# EAGLE design LlenadoPiscina (EAGLE 7.3.0)
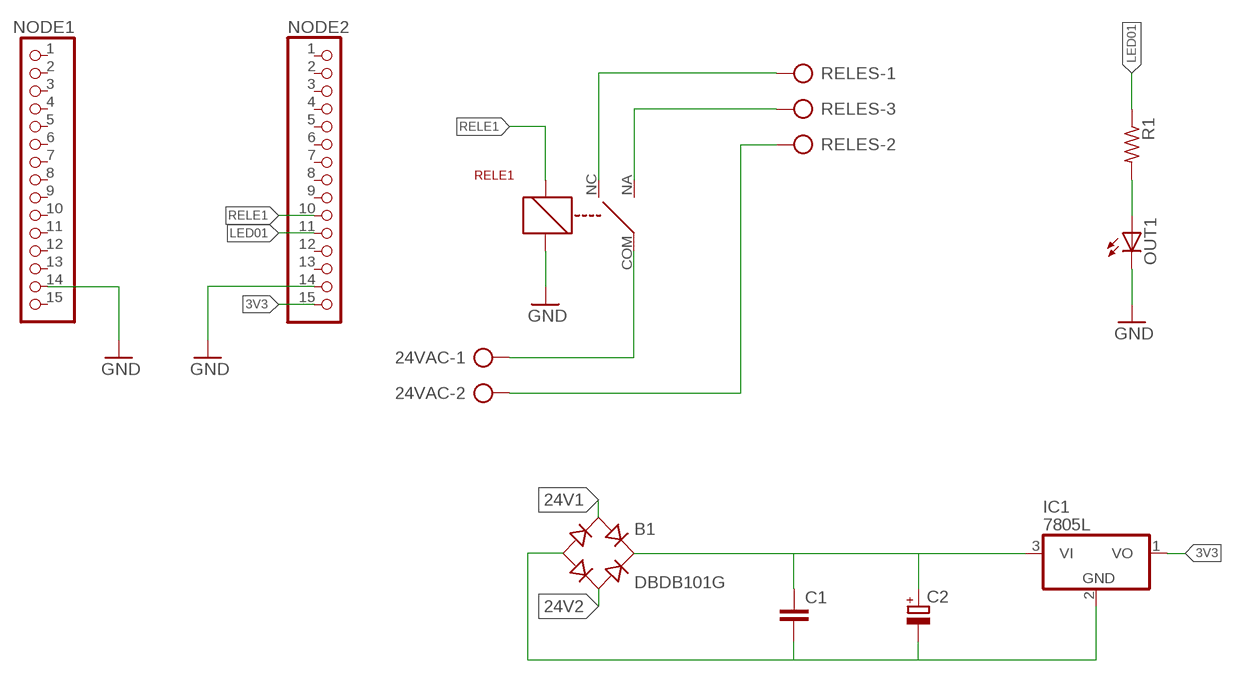
[diagram p0: schematic, sheet 1]

## Parts
24VAC  AK500/2-H  [AK500/2-H]
B1  DBDB101G  [DB]
C1  C2.5/2  [C2.5-2]
C2  CPOL-EUE2,5-6E  [E2,5-6E]
IC1  7805L  [TO92]
NODE1  PINHD-1X15  [1X15]
NODE2  PINHD-1X15  [1X15]
OUT1  LED3MM  [LED3MM]
R1  R-US_0204/7  [0204/7]
RELE1  RAS0510  [RAS0510]
RELES  AK500/3-H  [AK500/3-H]

## Nets
3V3: IC1.1(VO) NODE2.15
24V1: 24VAC.1 B1.AC1 RELE1.COM
24V2: 24VAC.2 B1.AC2 RELES.2
GND: NODE1.14 NODE2.14 OUT1.K(C) RELE1.B2
LED01: NODE2.11 R1.1
N$3: RELE1.NC RELES.1
N$4: RELE1.NA RELES.3
N$5: OUT1.A R1.2
N$6: B1.+ C1.1 C2.+ IC1.3(VI)
N$7: B1.- C1.2 C2.- IC1.2(GND)
RELE1: NODE2.10 RELE1.B1
Unconnected: NODE1.1 NODE1.2 NODE1.3 NODE1.4 NODE1.5 NODE1.6 NODE1.7 NODE1.8 NODE1.9 NODE1.10 NODE1.11 NODE1.12 NODE1.13 NODE1.15 NODE2.1 NODE2.2 NODE2.3 NODE2.4 NODE2.5 NODE2.6 NODE2.7 NODE2.8 NODE2.9 NODE2.12 NODE2.13

## Library data of the parts
24VAC = con-ptr500:AK500/2-H: CONNECTOR Aug. 2004 / PTR Meßtechnik: Die Bezeichnung der Serie AK505 wurde geändert. Es handelt sich hierbei um AK500 in horizontaler Ausführung.; OC_FARNELL: unknown; OC_NEWARK: unknown
B1 = rectifier:DB?*G: Single Phase 1.0 AMP Glass Passivated Bridge Rectifier Taiwan Semiconductor Co.,Ltd. - TSC Source: http://www.taiwansemi.com/TSCbig5/ezcatfiles/cust/img/img/db101g.pdf http://www.ts.com.tw/db/pictures/modules/PDT/PDT060207001/DBLS201G.pdf
C1 = capacitor-wima:C: CAPACITOR naming: grid - package width
C2 = resistor:CPOL-EU: POLARIZED CAPACITOR, European symbol
IC1 = linear:78*: Positive VOLTAGE REGULATOR Source: http://cache.national.com/ds/LM/LM78L05.pdf http://www.fairchildsemi.com/ds/LM/LM7805.pdf
NODE1 NODE2 = pinhead:PINHD-1X15: PIN HEADER
OUT1 = led:LED: LED OSRAM: - CHIPLED LG R971, LG N971, LY N971, LG Q971, LY Q971, LO R971, LY R971 LH N974, LH R974 LS Q976, LO Q976, LY Q976 LO Q996 - Hyper CHIPLED LW Q18S LB Q993, LB Q99A, LB R99A - SideLED LS A670, LO A670, LY A670, LG A670, LP A670 LB A673, LV A673, LT A673, LW A673 LH A674 LY A675 LS A676, LA A676, LO A676, LY A676, LW A676 LS A679, LY A679, LG A679 - Hyper Micro SIDELED® LS Y876, LA Y876, LO Y876, LY Y876 LT Y87S - SmartLED LW L88C, LW L88S LB L89C, LB L89S, LG L890 LS L89K, LO L89K, LY L89K LS L896, LA L896, LO L896, LY L896 - TOPLED LS T670, LO T670, LY T670, LG T670, LP T670 LSG T670, LSP T670, LSY T670, LOP T670, LYG T670 LG T671, LOG T671, LSG T671 LB T673, LV T673, LT T673, LW T673 LH T674 LS T676, LA T676, LO T676, LY T676, LB T676, LH T676, LSB T676, LW T676 LB T67C, LV T67C, LT T67C, LS T67K, LO T67K, LY T67K, LW E67C LS E67B, LA E67B, LO E67B, LY E67B, LB E67C, LV E67C, LT E67C LW T67C LS T679, LY T679, LG T679 LS T770, LO T770, LY T770, LG T770, LP T770 LB T773, LV T773, LT T773, LW T773 LH T774 LS E675, LA E675, LY E675, LS T675 LS T776, LA T776, LO T776, LY T776, LB T776 LHGB T686 LT T68C, LB T68C - Hyper Mini TOPLED® LB M676 - Mini TOPLED Santana® LG M470 LS M47K, LO M47K, LY M47K Source: http://www.osram.convergy.de LUXEON: - LUMILED® LXK2-PW12-R00, LXK2-PW12-S00, LXK2-PW14-U00, LXK2-PW14-V00 LXK2-PM12-R00, LXK2-PM12-S00, LXK2-PM14-U00 LXK2-PE12-Q00, LXK2-PE12-R00, LXK2-PE12-S00, LXK2-PE14-T00, LXK2-PE14-U00 LXK2-PB12-K00, LXK2-PB12-L00, LXK2-PB12-M00, LXK2-PB14-N00, LXK2-PB14-P00, LXK2-PB14-Q00 LXK2-PR12-L00, LXK2-PR12-M00, LXK2-PR14-Q00, LXK2-PR14-R00 LXK2-PD12-Q00, LXK2-PD12-R00, LXK2-PD12-S00 LXK2-PH12-R00, LXK2-PH12-S00 LXK2-PL12-P00, LXK2-PL12-Q00, LXK2-PL12-R00 Source: www.luxeon.com KINGBRIGHT: KA-3528ASYC Source: www.kingbright.com
R1 = resistor:R-US_: RESISTOR, American symbol
RELE1 = E-Lab:RAS0510
RELES = con-ptr500:AK500/3-H: CONNECTOR Aug. 2004 / PTR Meßtechnik: Die Bezeichnung der Serie AK505 wurde geändert. Es handelt sich hierbei um AK500 in horizontaler Ausführung.; OC_FARNELL: unknown; OC_NEWARK: unknown

## Board
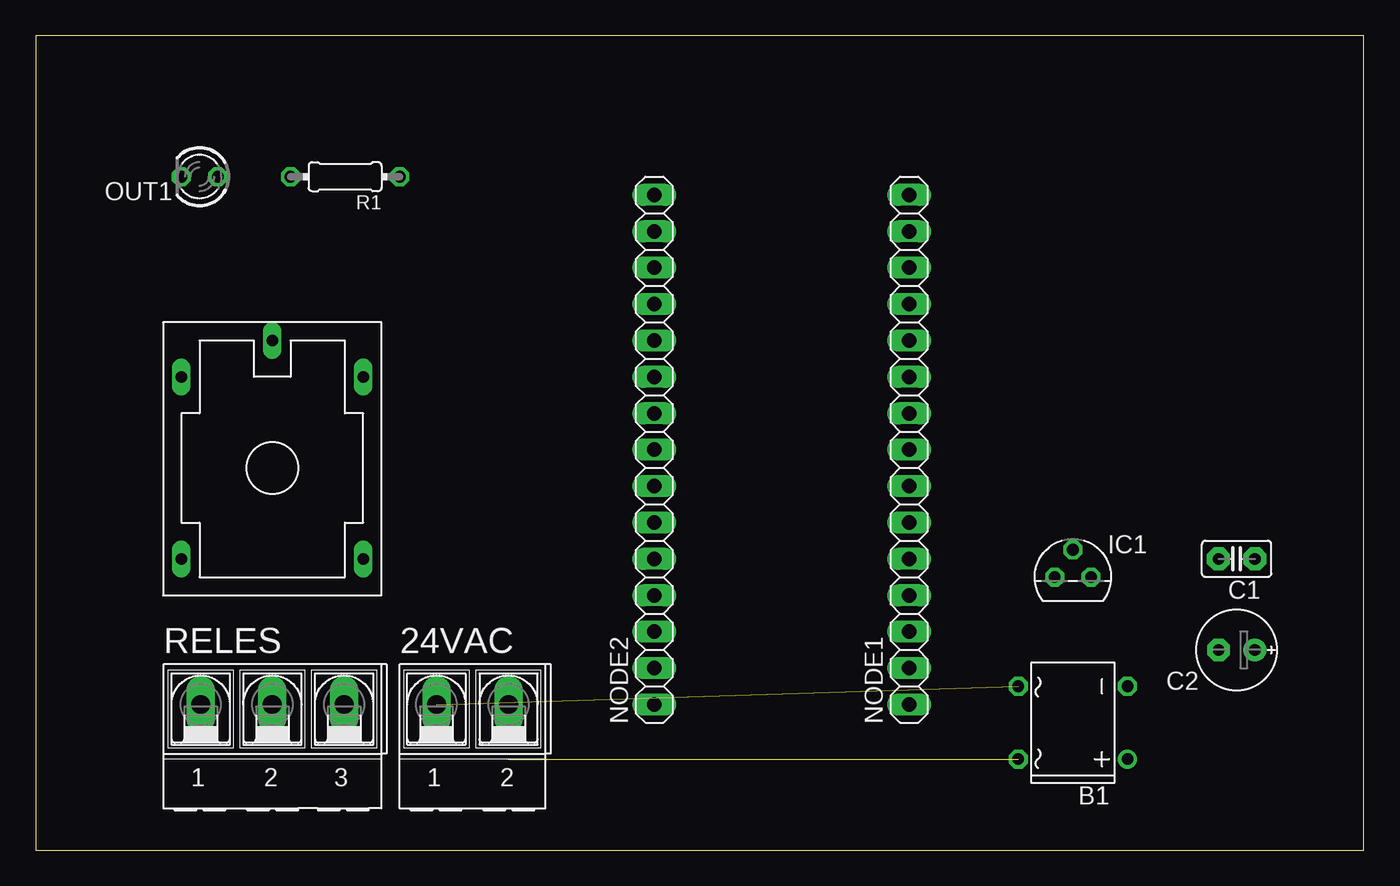
[diagram p1: board, top side]
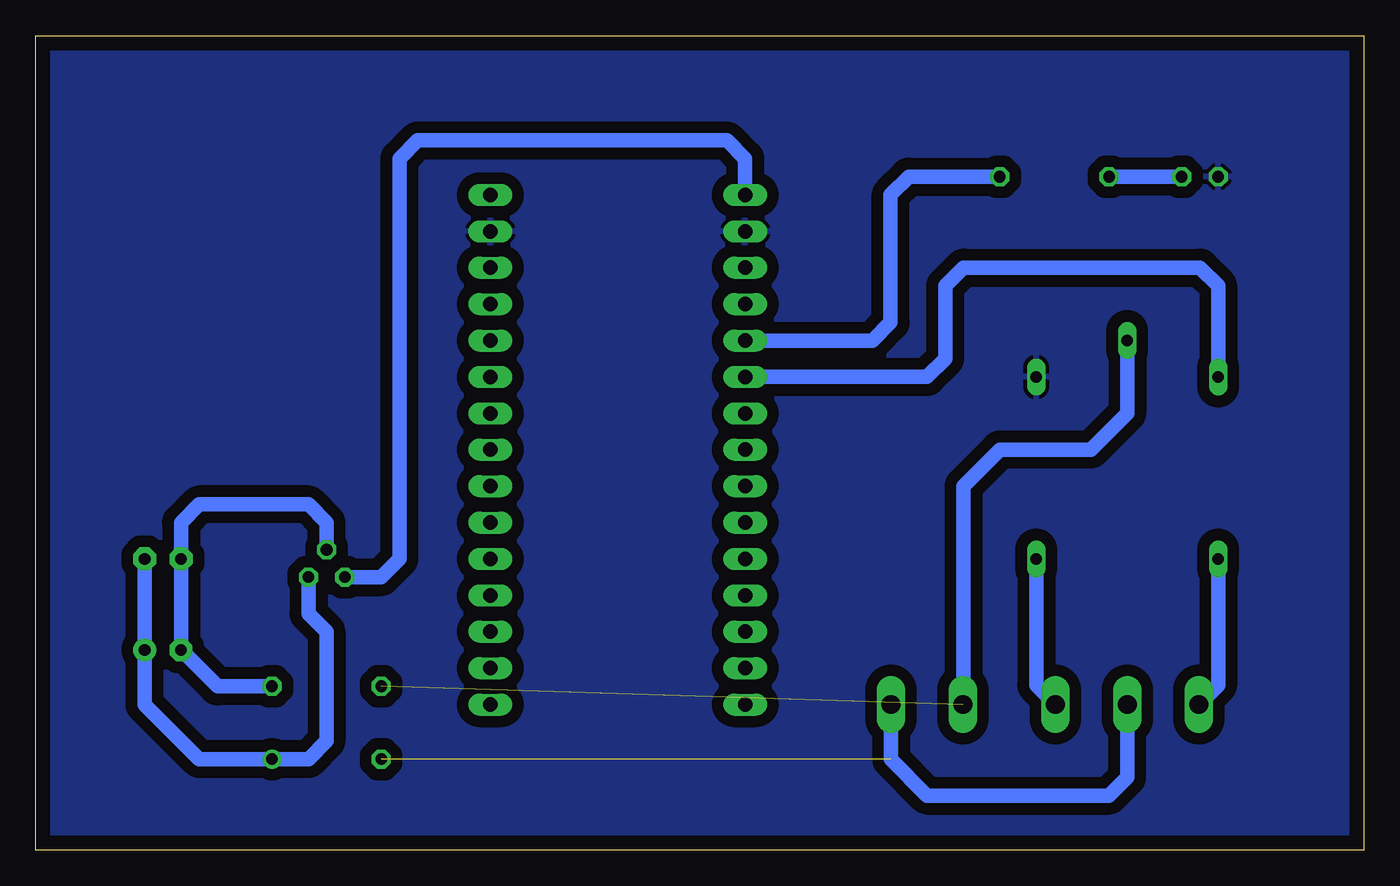
[diagram p2: board, bottom side, seen from below]

Size 92.69 x 56.82 mm. Coordinates in mm from the lower left corner, seen from the top.
Outline: 0,0 92.69,0 92.69,56.82 0,56.82 0,0
Copper layers (1*16): Top 0.035mm / dielectric 1.5mm / Bottom 0.035mm
Design rules "default": minimum track width 10mil, minimum drill 24mil, track to track 8mil, track to pad 8mil, pad to pad 8mil, via to via 8mil, smd to smd 8mil, copper to edge 40mil, drill to drill 8mil, minimum pad ring 10mil, minimum via ring 8mil, stop-mask expansion 4mil, vias tented up to drill 0mil, thermal gap 10mil

### Footprints (pad centres in the part's own frame; a part is rotated, then mirrored left to right if it is on the bottom)
AK500/2-H = drill 1.321 long: 1 -2.515,0; 2 2.515,0
DB = drill 0.813: + -2.54,-3.81 | drill 0.813 octagon: - 2.54,-3.81; AC1 2.54,3.81; AC2 -2.54,3.81
C2.5-2 = drill 0.813 pad 1.6 octagon: 1 -1.27,0; 2 1.27,0
E2,5-6E = drill 0.813 pad 1.575: + -1.27,0 | drill 0.813 pad 1.575 octagon: - 1.27,0
TO92 = drill 0.813 octagon: 1 -1.27,0; 2 0,1.905; 3 1.27,0
1X15 = drill 1.016 long: 1 -17.78,0; 2 -15.24,0; 3 -12.7,0; 4 -10.16,0; 5 -7.62,0; 6 -5.08,0; 7 -2.54,0; 8 0,0; 9 2.54,0; 10 5.08,0; 11 7.62,0; 12 10.16,0; 13 12.7,0; 14 15.24,0; 15 17.78,0
LED3MM = drill 0.813 octagon: A -1.27,0; K 1.27,0
0204/7 = drill 0.813 octagon: 1 -3.81,0; 2 3.81,0
RAS0510 = drill 0.8 long: B1 -6.35,6.35; B2 6.35,6.35; COM 0,8.89; NA 6.35,-6.35; NC -6.35,-6.35
AK500/3-H = drill 1.321 long: 1 -5.004,0; 2 0,0; 3 5.004,0

### Placement (x,y rotation side)
24VAC  30.48,10.16 0 top
B1  72.39,8.89 90 top
C1  83.82,20.32 180 top
C2  83.82,13.97 180 top
IC1  72.39,19.05 0 top
NODE1  60.96,27.94 90 top
NODE2  43.18,27.94 90 top
OUT1  11.43,46.99 180 top
R1  21.59,46.99 180 top
RELE1  16.51,26.67 0 top
RELES  16.51,10.16 0 top

### Tracks (layer width: path | path; a pad name or v marks a point on that pad's centre or on a via)
3V3
  Bottom 1.016: IC1.1 68.58,19.05 67.31,20.32 67.31,48.26 66.04,49.53 44.45,49.53 43.18,48.26 NODE2.15
24V1  (1 unrouted)
  Bottom 1.016: RELE1.COM 16.51,30.48 19.05,27.94 25.4,27.94 27.94,25.4 27.94,10.19 24VAC.1
24V2  (1 unrouted)
  Bottom 1.016: 24VAC.2 32.99,6.33 30.48,3.81 17.78,3.81 16.51,5.08 RELES.2
GND
  pour Bottom (isolate 0.813): 0,0 0,57.15 92.71,57.15 92.71,0
LED01
  Bottom 1.016: NODE2.11 34.29,35.56 33.02,36.83 33.02,45.72 31.75,46.99 R1.1
N$3
  Bottom 1.016: RELE1.NC 10.16,11.51 RELES.1
N$4
  Bottom 1.016: RELE1.NA 22.86,11.51 RELES.3
N$5
  Bottom 1.016: OUT1.A R1.2
N$6
  Bottom 1.016: C1.1 C2.+ 85.09,10.16 81.28,6.35 B1.+ 73.66,6.35 72.39,7.62 72.39,15.24 73.66,16.51 IC1.3
N$7
  Bottom 1.016: B1.- 80.01,11.43 C2.- C1.2 82.55,22.86 81.28,24.13 73.66,24.13 72.39,22.86 IC1.2
RELE1
  Bottom 1.016: RELE1.B1 10.16,39.37 11.43,40.64 27.94,40.64 29.21,39.37 29.21,34.29 30.48,33.02 NODE2.10